# Altium schematic sheet main.SchDoc
size A4; SheetNumber: 1; SheetTotal: 3
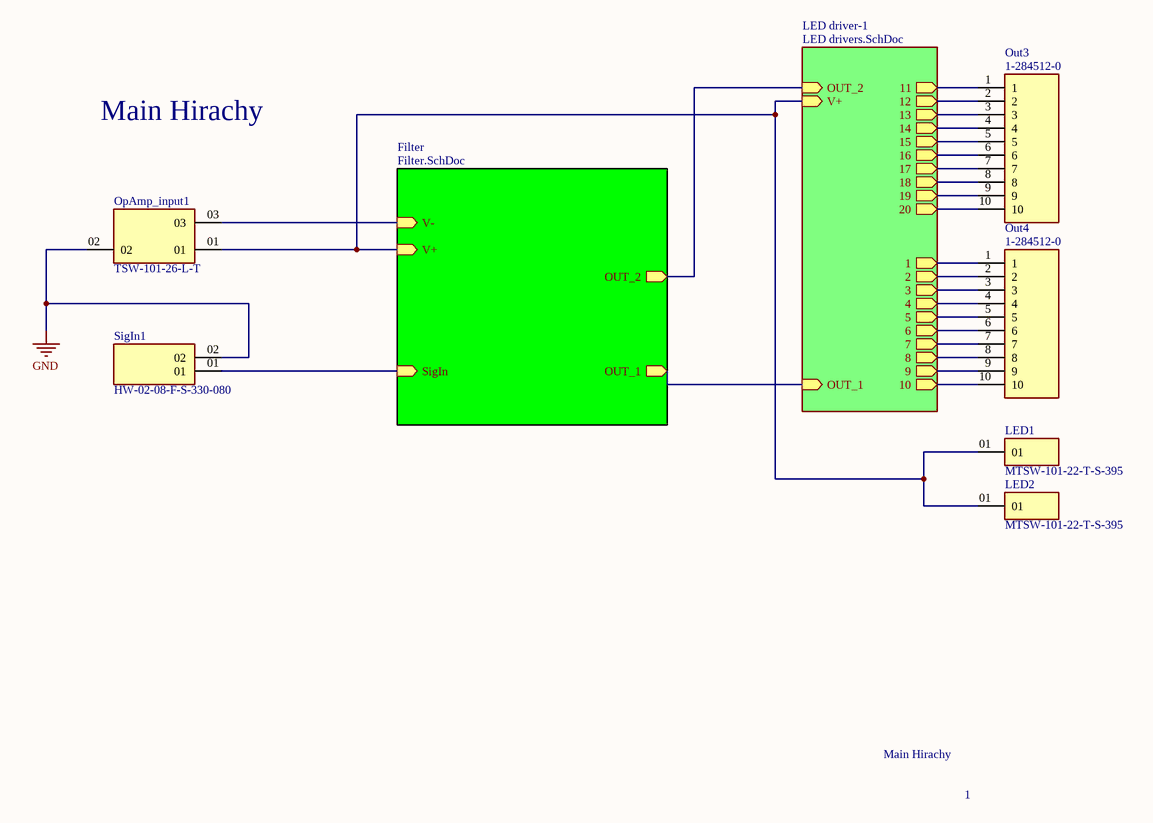
[diagram p0: main.SchDoc]

## Parts
LED1  MTSW-101-22-T-S-395  [SAMTEC_MTSW-101-22-T-S-395]
LED2  MTSW-101-22-T-S-395  [SAMTEC_MTSW-101-22-T-S-395]
OpAmp_input1  TSW-101-26-L-T  [SAMTEC_TSW-101-26-L-T]
Out3  1-284512-0  [TE_1-284512-0]
Out4  1-284512-0  [TE_1-284512-0]
SigIn1  HW-02-08-F-S-330-080  [SAMTEC_HW-02-08-F-S-330-080]

## Sub-sheets
Filter = Filter.SchDoc: OUT_1 (out), OUT_2 (out), SigIn (in), V+ (in), V- (in)
LED driver-1 = LED drivers.SchDoc: 10 (out), 9 (out), 8 (out), 7 (out), 6 (out), 5 (out), 4 (out), 3 (out), 2 (out), 1 (out), OUT_1 (in), 20 (out), 19 (out), 18 (out), 17 (out), 16 (out), 15 (out), 14 (out), 13 (out), 12 (out), 11 (out), OUT_2 (in), V+ (in)

## Nets
GND: OpAmp_input1.02 SigIn1.02
NetLED1_01: LED1.01 LED2.01 OpAmp_input1.01 ; sheet Filter/V+, sheet LED driver-1/V+
NetOpAmp_input1_03: OpAmp_input1.03 ; sheet Filter/V-
NetOut3_1: Out3.1 ; sheet LED driver-1/11
NetOut3_2: Out3.2 ; sheet LED driver-1/12
NetOut3_3: Out3.3 ; sheet LED driver-1/13
NetOut3_4: Out3.4 ; sheet LED driver-1/14
NetOut3_5: Out3.5 ; sheet LED driver-1/15
NetOut3_6: Out3.6 ; sheet LED driver-1/16
NetOut3_7: Out3.7 ; sheet LED driver-1/17
NetOut3_8: Out3.8 ; sheet LED driver-1/18
NetOut3_9: Out3.9 ; sheet LED driver-1/19
NetOut3_10: Out3.10 ; sheet LED driver-1/20
NetOut4_1: Out4.1 ; sheet LED driver-1/1
NetOut4_2: Out4.2 ; sheet LED driver-1/2
NetOut4_3: Out4.3 ; sheet LED driver-1/3
NetOut4_4: Out4.4 ; sheet LED driver-1/4
NetOut4_5: Out4.5 ; sheet LED driver-1/5
NetOut4_6: Out4.6 ; sheet LED driver-1/6
NetOut4_7: Out4.7 ; sheet LED driver-1/7
NetOut4_8: Out4.8 ; sheet LED driver-1/8
NetOut4_9: Out4.9 ; sheet LED driver-1/9
NetOut4_10: Out4.10 ; sheet LED driver-1/10
NetSigIn1_01: SigIn1.01 ; sheet Filter/SigIn
(unnamed): sheet Filter/OUT_1, sheet LED driver-1/OUT_1
(unnamed): sheet Filter/OUT_2, sheet LED driver-1/OUT_2

## Notes on the sheet
- Main Hirachy
- 1

## Library data of the parts
LED1 LED2 = MTSW-101-22-T-S-395: Connector Header Through Hole 1 position; MF: Samtec; Package: None; Value: *; Check_prices: https://www.snapeda.com/parts/MTSW-101-22-T-S-395/Samtec/view-part/?ref=eda; SnapEDA_Link: https://www.snapeda.com/parts/MTSW-101-22-T-S-395/Samtec/view-part/?ref=snap; Availability: In Stock; Price: None; MP: MTSW-101-22-T-S-395; Purchase-URL: https://pricing.snapeda.com/search/part/MTSW-101-22-T-S-395/?ref=eda
Out3 Out4 = 1-284512-0: 10 POS TERMI-BLOK HDR 900 POLA; Number_of_Positions: 10; MF: TE Connectivity; Centerline_Pitch: 3.5 mm[.138 in]; Package: None; TE_purchase_URL: https://www.te.com/usa-en/product-1-284512-0.html?te_bu=Cor&te_type=disp&te_campaign=seda_glo_cor-seda-global-disp-prtnr-fy19-seda-model-bom-cta_sma-317_1&elqCampaignId=32493; Value: *; SnapEDA_Link: https://www.snapeda.com/parts/1-284512-0/TE%20Connectivity%20AMP%20Connectors/view-part/2366032/?ref=snap; Price: None; MP: 1-284512-0; Availability: Unavailable; EU_RoHS_Compliance: Compliant
OpAmp_input1 = TSW-101-26-L-T: Package: None; Price: None; Value: *; MP: TSW-101-26-L-T; Availability: Unavailable
SigIn1 = HW-02-08-F-S-330-080: Availability: Unavailable; Price: None; Package: None; MP: HW-02-08-F-S-330-080; Value: *